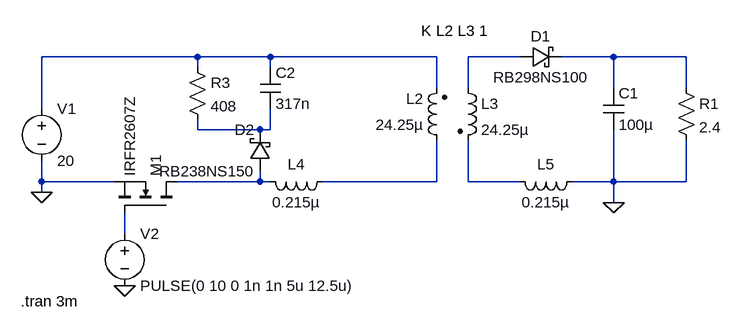
[diagram p0: schematic sim_openloop.asc]
sim_openloop.asc, the LTspice schematic file:
Version 4
SHEET 1 1132 680
WIRE 320 32 80 32
WIRE 432 32 320 32
WIRE 688 32 432 32
WIRE 816 32 736 32
WIRE 960 32 880 32
WIRE 1072 32 960 32
WIRE 320 48 320 32
WIRE 432 48 432 32
WIRE 688 80 688 32
WIRE 736 80 736 32
WIRE 960 80 960 32
WIRE 1072 80 1072 32
WIRE 80 112 80 32
WIRE 320 144 320 128
WIRE 416 144 320 144
WIRE 432 144 432 112
WIRE 432 144 416 144
WIRE 80 224 80 192
WIRE 192 224 80 224
WIRE 416 224 416 208
WIRE 416 224 288 224
WIRE 432 224 416 224
WIRE 688 224 688 160
WIRE 688 224 512 224
WIRE 736 224 736 160
WIRE 816 224 736 224
WIRE 960 224 960 144
WIRE 960 224 896 224
WIRE 1072 224 1072 160
WIRE 1072 224 960 224
WIRE 80 240 80 224
WIRE 960 256 960 224
WIRE 208 304 208 272
FLAG 80 240 0
FLAG 208 384 0
FLAG 960 256 0
SYMBOL voltage 80 96 R0
WINDOW 123 0 0 Left 0
WINDOW 39 0 0 Left 0
SYMATTR InstName V1
SYMATTR Value 20
SYMBOL nmos 288 272 M270
SYMATTR InstName M1
SYMATTR Value IRFR2607Z
SYMBOL ind2 704 176 R180
WINDOW 0 36 80 Left 2
WINDOW 3 36 40 Left 2
SYMATTR InstName L2
SYMATTR Value 24.25µ
SYMATTR Type ind
SYMATTR SpiceLine Rser=4.5m Rpar=33
SYMBOL ind2 720 64 R0
SYMATTR InstName L3
SYMATTR Value 24.25µ
SYMATTR Type ind
SYMBOL schottky 816 48 R270
WINDOW 0 32 32 VTop 2
WINDOW 3 0 32 VBottom 2
SYMATTR InstName D1
SYMATTR Value RB298NS100
SYMATTR Description Diode
SYMATTR Type diode
SYMBOL cap 944 80 R0
SYMATTR InstName C1
SYMATTR Value 100µ
SYMBOL res 1056 64 R0
SYMATTR InstName R1
SYMATTR Value 2.4
SYMBOL voltage 208 288 R0
WINDOW 123 0 0 Left 0
WINDOW 39 0 0 Left 0
SYMATTR InstName V2
SYMATTR Value PULSE(0 10 0 1n 1n 5u 12.5u)
SYMBOL res 304 32 R0
SYMATTR InstName R3
SYMATTR Value 408
SYMBOL cap 416 48 R0
SYMATTR InstName C2
SYMATTR Value 317n
SYMBOL ind 528 208 R90
WINDOW 0 5 56 VBottom 2
WINDOW 3 32 56 VTop 2
SYMATTR InstName L4
SYMATTR Value 0.215µ
SYMBOL ind 912 208 R90
WINDOW 0 5 56 VBottom 2
WINDOW 3 32 56 VTop 2
SYMATTR InstName L5
SYMATTR Value 0.215µ
SYMBOL schottky 432 208 R180
WINDOW 0 24 64 Left 2
WINDOW 3 24 0 Left 2
SYMATTR InstName D2
SYMATTR Value RB238NS150
SYMATTR Description Diode
SYMATTR Type diode
TEXT 664 -8 Left 2 !K L2 L3 1
TEXT 48 408 Left 2 !.tran 3m

The netlist it stands for:
* sim_openloop.asc
V1 N001 0 20
M1 N005 N008 0 0 IRFR2607Z
L2 N006 N001 24.25µ Rser=4.5m Rpar=33
L3 N002 N007 24.25µ
D1 N002 N003 RB298NS100
C1 N003 0 100µ
R1 N003 0 2.4
V2 N008 0 PULSE(0 10 0 1n 1n 5u 12.5u)
R3 N001 N004 408
C2 N001 N004 317n
L4 N006 N005 0.215µ
L5 0 N007 0.215µ
D2 N005 N004 RB238NS150
.model D D
.lib standard.dio
.model NMOS NMOS
.model PMOS PMOS
.lib standard.mos
K L2 L3 1
.tran 3m
.backanno
.end